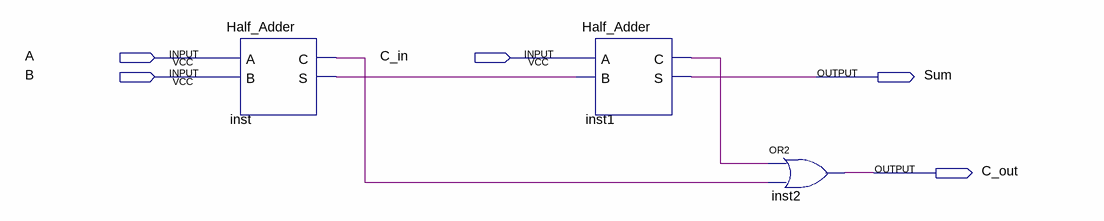
[diagram p0: schematic sheet]
// Quartus schematic Full_Adder.bdf as structural Verilog: 3 symbols, 5 pins
module Full_Adder (
  input  A,
  input  C_in,
  input  B,
  output Sum,
  output C_out
);

  wire inst1_c, inst_c, inst_s;

  Half_Adder inst (.A(A), .B(B), .C(inst_c), .S(inst_s));
  Half_Adder inst1 (.A(C_in), .B(inst_s), .C(inst1_c), .S(Sum));
  or inst2 (C_out, inst1_c, inst_c);
endmodule
